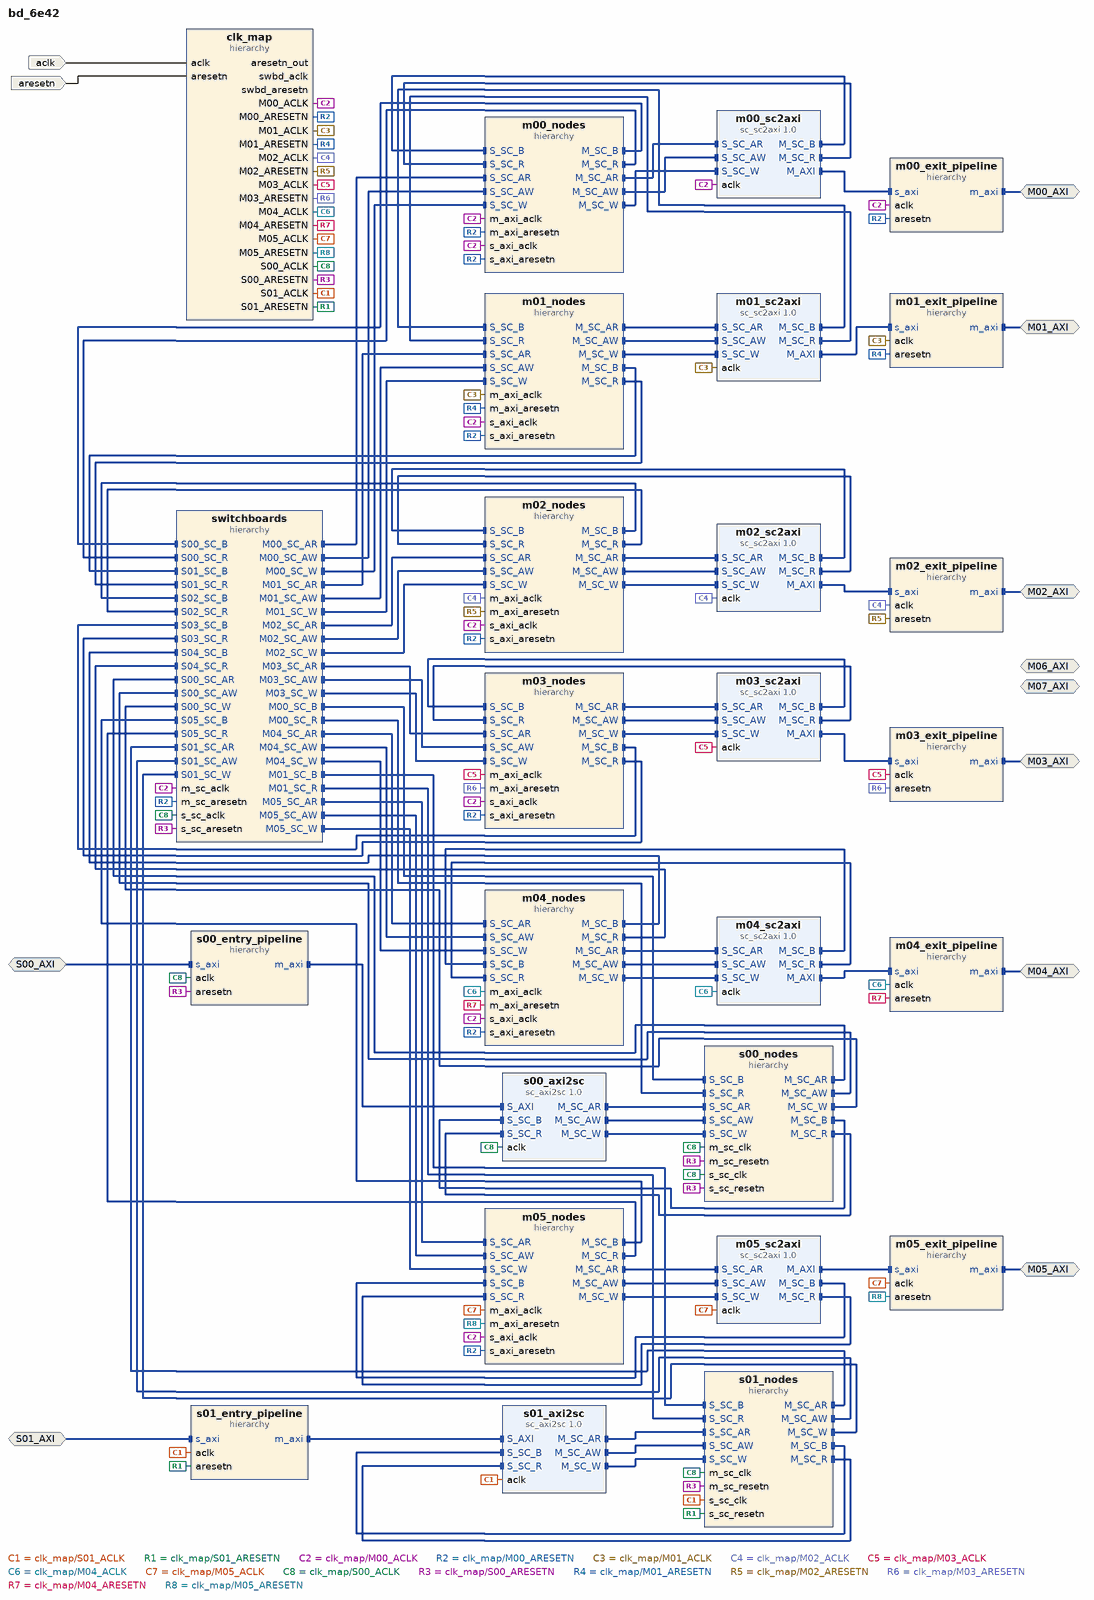
[diagram p0: block diagram of the top level]
# Vivado block design bd_6e42, xczu48dr-ffvg1517-2-e, Vivado 2025.1
create_bd_design bd_6e42

create_bd_intf_port -mode Slave -vlnv xilinx.com:interface:aximm_rtl:1.0 S00_AXI
set_property -dict {CONFIG.NUM_READ_OUTSTANDING 8 CONFIG.NUM_WRITE_OUTSTANDING 8} [get_bd_intf_ports S00_AXI]
create_bd_intf_port -mode Slave -vlnv xilinx.com:interface:aximm_rtl:1.0 S01_AXI
set_property -dict {CONFIG.NUM_READ_OUTSTANDING 8 CONFIG.NUM_WRITE_OUTSTANDING 8} [get_bd_intf_ports S01_AXI]
create_bd_intf_port -mode Master -vlnv xilinx.com:interface:aximm_rtl:1.0 M00_AXI
set_property -dict [list \
  CONFIG.NUM_READ_OUTSTANDING 8 \
  CONFIG.NUM_READ_THREADS 1 \
  CONFIG.NUM_WRITE_OUTSTANDING 8 \
  CONFIG.NUM_WRITE_THREADS 1 \
  CONFIG.RUSER_BITS_PER_BYTE 0 \
  CONFIG.WUSER_BITS_PER_BYTE 0 \
] [get_bd_intf_ports M00_AXI]
create_bd_intf_port -mode Master -vlnv xilinx.com:interface:aximm_rtl:1.0 M01_AXI
set_property -dict [list \
  CONFIG.NUM_READ_OUTSTANDING 8 \
  CONFIG.NUM_READ_THREADS 1 \
  CONFIG.NUM_WRITE_OUTSTANDING 8 \
  CONFIG.NUM_WRITE_THREADS 1 \
  CONFIG.RUSER_BITS_PER_BYTE 0 \
  CONFIG.WUSER_BITS_PER_BYTE 0 \
] [get_bd_intf_ports M01_AXI]
create_bd_intf_port -mode Master -vlnv xilinx.com:interface:aximm_rtl:1.0 M02_AXI
set_property -dict [list \
  CONFIG.NUM_READ_OUTSTANDING 8 \
  CONFIG.NUM_READ_THREADS 1 \
  CONFIG.NUM_WRITE_OUTSTANDING 8 \
  CONFIG.NUM_WRITE_THREADS 1 \
  CONFIG.RUSER_BITS_PER_BYTE 0 \
  CONFIG.WUSER_BITS_PER_BYTE 0 \
] [get_bd_intf_ports M02_AXI]
create_bd_intf_port -mode Master -vlnv xilinx.com:interface:aximm_rtl:1.0 M03_AXI
set_property -dict [list \
  CONFIG.NUM_READ_OUTSTANDING 8 \
  CONFIG.NUM_READ_THREADS 1 \
  CONFIG.NUM_WRITE_OUTSTANDING 8 \
  CONFIG.NUM_WRITE_THREADS 1 \
  CONFIG.RUSER_BITS_PER_BYTE 0 \
  CONFIG.WUSER_BITS_PER_BYTE 0 \
] [get_bd_intf_ports M03_AXI]
create_bd_intf_port -mode Master -vlnv xilinx.com:interface:aximm_rtl:1.0 M04_AXI
set_property -dict [list \
  CONFIG.NUM_READ_OUTSTANDING 8 \
  CONFIG.NUM_READ_THREADS 1 \
  CONFIG.NUM_WRITE_OUTSTANDING 8 \
  CONFIG.NUM_WRITE_THREADS 1 \
  CONFIG.RUSER_BITS_PER_BYTE 0 \
  CONFIG.WUSER_BITS_PER_BYTE 0 \
] [get_bd_intf_ports M04_AXI]
create_bd_intf_port -mode Master -vlnv xilinx.com:interface:aximm_rtl:1.0 M05_AXI
set_property -dict [list \
  CONFIG.NUM_READ_OUTSTANDING 8 \
  CONFIG.NUM_READ_THREADS 1 \
  CONFIG.NUM_WRITE_OUTSTANDING 8 \
  CONFIG.NUM_WRITE_THREADS 1 \
  CONFIG.RUSER_BITS_PER_BYTE 0 \
  CONFIG.WUSER_BITS_PER_BYTE 0 \
] [get_bd_intf_ports M05_AXI]
create_bd_intf_port -mode Master -vlnv xilinx.com:interface:aximm_rtl:1.0 M06_AXI
set_property -dict [list \
  CONFIG.NUM_READ_OUTSTANDING 8 \
  CONFIG.NUM_READ_THREADS 1 \
  CONFIG.NUM_WRITE_OUTSTANDING 8 \
  CONFIG.NUM_WRITE_THREADS 1 \
  CONFIG.RUSER_BITS_PER_BYTE 0 \
  CONFIG.WUSER_BITS_PER_BYTE 0 \
] [get_bd_intf_ports M06_AXI]
create_bd_intf_port -mode Master -vlnv xilinx.com:interface:aximm_rtl:1.0 M07_AXI
set_property -dict [list \
  CONFIG.NUM_READ_OUTSTANDING 8 \
  CONFIG.NUM_READ_THREADS 1 \
  CONFIG.NUM_WRITE_OUTSTANDING 8 \
  CONFIG.NUM_WRITE_THREADS 1 \
  CONFIG.RUSER_BITS_PER_BYTE 0 \
  CONFIG.WUSER_BITS_PER_BYTE 0 \
] [get_bd_intf_ports M07_AXI]
create_bd_port -dir I -type clk aclk
set_property -dict [list \
  CONFIG.ASSOCIATED_BUSIF M00_AXI:M01_AXI:M02_AXI:M03_AXI:M04_AXI:M05_AXI:M06_AXI:M07_AXI:S00_AXI:S01_AXI \
] [get_bd_ports aclk]
create_bd_port -dir I -type rst aresetn
set_property -dict {CONFIG.POLARITY ACTIVE_LOW} [get_bd_ports aresetn]

create_bd_cell -type hier clk_map
create_bd_cell -type hier switchboards
create_bd_cell -type hier s00_entry_pipeline
create_bd_cell -type ip -vlnv xilinx.com:ip:sc_axi2sc:1.0 s00_axi2sc
set_property -dict [list \
  CONFIG.AXI_ADDR_WIDTH 40 \
  CONFIG.AXI_ID_WIDTH 2 \
  CONFIG.AXI_RDATA_WIDTH 128 \
  CONFIG.AXI_WDATA_WIDTH 128 \
  CONFIG.MSC_ROUTE_WIDTH 10 \
  CONFIG.READ_WRITE_MODE READ_WRITE \
  CONFIG.SC_ADDR_WIDTH 40 \
  CONFIG.SC_ARUSER_WIDTH 16 \
  CONFIG.SC_AWUSER_WIDTH 16 \
  CONFIG.SC_BUSER_WIDTH 0 \
  CONFIG.SC_ID_WIDTH 2 \
  CONFIG.SC_RDATA_WIDTH 128 \
  CONFIG.SC_RUSER_BITS_PER_BYTE 0 \
  CONFIG.SC_WDATA_WIDTH 128 \
  CONFIG.SC_WUSER_BITS_PER_BYTE 0 \
  CONFIG.SSC_ROUTE_WIDTH 4 \
] [get_bd_cells s00_axi2sc]
create_bd_cell -type hier s00_nodes
create_bd_cell -type hier s01_entry_pipeline
create_bd_cell -type ip -vlnv xilinx.com:ip:sc_axi2sc:1.0 s01_axi2sc
set_property -dict [list \
  CONFIG.AXI_ADDR_WIDTH 40 \
  CONFIG.AXI_ID_WIDTH 2 \
  CONFIG.AXI_RDATA_WIDTH 128 \
  CONFIG.AXI_WDATA_WIDTH 128 \
  CONFIG.MSC_ROUTE_WIDTH 10 \
  CONFIG.READ_WRITE_MODE READ_WRITE \
  CONFIG.SC_ADDR_WIDTH 40 \
  CONFIG.SC_ARUSER_WIDTH 16 \
  CONFIG.SC_AWUSER_WIDTH 16 \
  CONFIG.SC_BUSER_WIDTH 0 \
  CONFIG.SC_ID_WIDTH 2 \
  CONFIG.SC_RDATA_WIDTH 128 \
  CONFIG.SC_RUSER_BITS_PER_BYTE 0 \
  CONFIG.SC_WDATA_WIDTH 128 \
  CONFIG.SC_WUSER_BITS_PER_BYTE 0 \
  CONFIG.SSC_ROUTE_WIDTH 4 \
] [get_bd_cells s01_axi2sc]
create_bd_cell -type hier s01_nodes
create_bd_cell -type ip -vlnv xilinx.com:ip:sc_sc2axi:1.0 m00_sc2axi
set_property -dict [list \
  CONFIG.AXI_ADDR_WIDTH 10 \
  CONFIG.AXI_ID_WIDTH 2 \
  CONFIG.AXI_RDATA_WIDTH 32 \
  CONFIG.AXI_WDATA_WIDTH 32 \
  CONFIG.MSC_ROUTE_WIDTH 10 \
  CONFIG.READ_WRITE_MODE READ_WRITE \
  CONFIG.SC_ADDR_WIDTH 40 \
  CONFIG.SC_ARUSER_WIDTH 16 \
  CONFIG.SC_AWUSER_WIDTH 16 \
  CONFIG.SC_BUSER_WIDTH 0 \
  CONFIG.SC_ID_WIDTH 2 \
  CONFIG.SC_RDATA_WIDTH 128 \
  CONFIG.SC_RUSER_BITS_PER_BYTE 0 \
  CONFIG.SC_WDATA_WIDTH 128 \
  CONFIG.SC_WUSER_BITS_PER_BYTE 0 \
  CONFIG.SSC_ROUTE_WIDTH 4 \
] [get_bd_cells m00_sc2axi]
create_bd_cell -type hier m00_nodes
create_bd_cell -type hier m00_exit_pipeline
create_bd_cell -type ip -vlnv xilinx.com:ip:sc_sc2axi:1.0 m01_sc2axi
set_property -dict [list \
  CONFIG.AXI_ADDR_WIDTH 10 \
  CONFIG.AXI_ID_WIDTH 2 \
  CONFIG.AXI_RDATA_WIDTH 32 \
  CONFIG.AXI_WDATA_WIDTH 32 \
  CONFIG.MSC_ROUTE_WIDTH 10 \
  CONFIG.READ_WRITE_MODE READ_WRITE \
  CONFIG.SC_ADDR_WIDTH 40 \
  CONFIG.SC_ARUSER_WIDTH 16 \
  CONFIG.SC_AWUSER_WIDTH 16 \
  CONFIG.SC_BUSER_WIDTH 0 \
  CONFIG.SC_ID_WIDTH 2 \
  CONFIG.SC_RDATA_WIDTH 128 \
  CONFIG.SC_RUSER_BITS_PER_BYTE 0 \
  CONFIG.SC_WDATA_WIDTH 128 \
  CONFIG.SC_WUSER_BITS_PER_BYTE 0 \
  CONFIG.SSC_ROUTE_WIDTH 4 \
] [get_bd_cells m01_sc2axi]
create_bd_cell -type hier m01_nodes
create_bd_cell -type hier m01_exit_pipeline
create_bd_cell -type ip -vlnv xilinx.com:ip:sc_sc2axi:1.0 m02_sc2axi
set_property -dict [list \
  CONFIG.AXI_ADDR_WIDTH 10 \
  CONFIG.AXI_ID_WIDTH 2 \
  CONFIG.AXI_RDATA_WIDTH 32 \
  CONFIG.AXI_WDATA_WIDTH 32 \
  CONFIG.MSC_ROUTE_WIDTH 10 \
  CONFIG.READ_WRITE_MODE READ_WRITE \
  CONFIG.SC_ADDR_WIDTH 40 \
  CONFIG.SC_ARUSER_WIDTH 16 \
  CONFIG.SC_AWUSER_WIDTH 16 \
  CONFIG.SC_BUSER_WIDTH 0 \
  CONFIG.SC_ID_WIDTH 2 \
  CONFIG.SC_RDATA_WIDTH 128 \
  CONFIG.SC_RUSER_BITS_PER_BYTE 0 \
  CONFIG.SC_WDATA_WIDTH 128 \
  CONFIG.SC_WUSER_BITS_PER_BYTE 0 \
  CONFIG.SSC_ROUTE_WIDTH 4 \
] [get_bd_cells m02_sc2axi]
create_bd_cell -type hier m02_nodes
create_bd_cell -type hier m02_exit_pipeline
create_bd_cell -type ip -vlnv xilinx.com:ip:sc_sc2axi:1.0 m03_sc2axi
set_property -dict [list \
  CONFIG.AXI_ADDR_WIDTH 10 \
  CONFIG.AXI_ID_WIDTH 2 \
  CONFIG.AXI_RDATA_WIDTH 32 \
  CONFIG.AXI_WDATA_WIDTH 32 \
  CONFIG.MSC_ROUTE_WIDTH 10 \
  CONFIG.READ_WRITE_MODE READ_WRITE \
  CONFIG.SC_ADDR_WIDTH 40 \
  CONFIG.SC_ARUSER_WIDTH 16 \
  CONFIG.SC_AWUSER_WIDTH 16 \
  CONFIG.SC_BUSER_WIDTH 0 \
  CONFIG.SC_ID_WIDTH 2 \
  CONFIG.SC_RDATA_WIDTH 128 \
  CONFIG.SC_RUSER_BITS_PER_BYTE 0 \
  CONFIG.SC_WDATA_WIDTH 128 \
  CONFIG.SC_WUSER_BITS_PER_BYTE 0 \
  CONFIG.SSC_ROUTE_WIDTH 4 \
] [get_bd_cells m03_sc2axi]
create_bd_cell -type hier m03_nodes
create_bd_cell -type hier m03_exit_pipeline
create_bd_cell -type ip -vlnv xilinx.com:ip:sc_sc2axi:1.0 m04_sc2axi
set_property -dict [list \
  CONFIG.AXI_ADDR_WIDTH 5 \
  CONFIG.AXI_ID_WIDTH 2 \
  CONFIG.AXI_RDATA_WIDTH 32 \
  CONFIG.AXI_WDATA_WIDTH 32 \
  CONFIG.MSC_ROUTE_WIDTH 10 \
  CONFIG.READ_WRITE_MODE READ_WRITE \
  CONFIG.SC_ADDR_WIDTH 40 \
  CONFIG.SC_ARUSER_WIDTH 16 \
  CONFIG.SC_AWUSER_WIDTH 16 \
  CONFIG.SC_BUSER_WIDTH 0 \
  CONFIG.SC_ID_WIDTH 2 \
  CONFIG.SC_RDATA_WIDTH 128 \
  CONFIG.SC_RUSER_BITS_PER_BYTE 0 \
  CONFIG.SC_WDATA_WIDTH 128 \
  CONFIG.SC_WUSER_BITS_PER_BYTE 0 \
  CONFIG.SSC_ROUTE_WIDTH 4 \
] [get_bd_cells m04_sc2axi]
create_bd_cell -type hier m04_nodes
create_bd_cell -type hier m04_exit_pipeline
create_bd_cell -type ip -vlnv xilinx.com:ip:sc_sc2axi:1.0 m05_sc2axi
set_property -dict [list \
  CONFIG.AXI_ADDR_WIDTH 18 \
  CONFIG.AXI_ID_WIDTH 2 \
  CONFIG.AXI_RDATA_WIDTH 32 \
  CONFIG.AXI_WDATA_WIDTH 32 \
  CONFIG.MSC_ROUTE_WIDTH 10 \
  CONFIG.READ_WRITE_MODE READ_WRITE \
  CONFIG.SC_ADDR_WIDTH 40 \
  CONFIG.SC_ARUSER_WIDTH 16 \
  CONFIG.SC_AWUSER_WIDTH 16 \
  CONFIG.SC_BUSER_WIDTH 0 \
  CONFIG.SC_ID_WIDTH 2 \
  CONFIG.SC_RDATA_WIDTH 128 \
  CONFIG.SC_RUSER_BITS_PER_BYTE 0 \
  CONFIG.SC_WDATA_WIDTH 128 \
  CONFIG.SC_WUSER_BITS_PER_BYTE 0 \
  CONFIG.SSC_ROUTE_WIDTH 4 \
] [get_bd_cells m05_sc2axi]
create_bd_cell -type hier m05_nodes
create_bd_cell -type hier m05_exit_pipeline

# ---- hierarchy /clk_map ----
current_bd_instance /clk_map
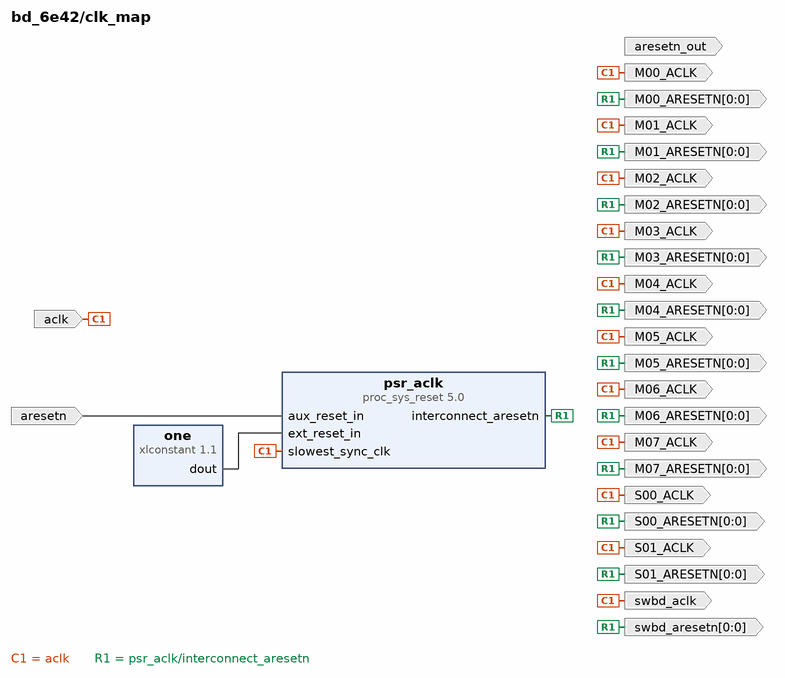
[diagram p1: block diagram inside /clk_map]
create_bd_pin -dir O -type clk S00_ACLK
create_bd_pin -dir O -from 0 -to 0 -type rst S00_ARESETN
create_bd_pin -dir O -type clk S01_ACLK
create_bd_pin -dir O -from 0 -to 0 -type rst S01_ARESETN
create_bd_pin -dir O -type clk M00_ACLK
create_bd_pin -dir O -from 0 -to 0 -type rst M00_ARESETN
create_bd_pin -dir O -type clk M01_ACLK
create_bd_pin -dir O -from 0 -to 0 -type rst M01_ARESETN
create_bd_pin -dir O -type clk M02_ACLK
create_bd_pin -dir O -from 0 -to 0 -type rst M02_ARESETN
create_bd_pin -dir O -type clk M03_ACLK
create_bd_pin -dir O -from 0 -to 0 -type rst M03_ARESETN
create_bd_pin -dir O -type clk M04_ACLK
create_bd_pin -dir O -from 0 -to 0 -type rst M04_ARESETN
create_bd_pin -dir O -type clk M05_ACLK
create_bd_pin -dir O -from 0 -to 0 -type rst M05_ARESETN
create_bd_pin -dir O -type clk M06_ACLK
create_bd_pin -dir O -from 0 -to 0 -type rst M06_ARESETN
create_bd_pin -dir O -type clk M07_ACLK
create_bd_pin -dir O -from 0 -to 0 -type rst M07_ARESETN
create_bd_pin -dir O -type clk swbd_aclk
create_bd_pin -dir O -from 0 -to 0 -type rst swbd_aresetn
create_bd_pin -dir I -type rst aresetn
create_bd_pin -dir O -type rst aresetn_out
create_bd_pin -dir I -type clk aclk

create_bd_cell -type ip -vlnv xilinx.com:ip:xlconstant:1.1 one
create_bd_cell -type ip -vlnv xilinx.com:ip:proc_sys_reset:5.0 psr_aclk
set_property -dict {CONFIG.C_AUX_RESET_HIGH 0 CONFIG.C_AUX_RST_WIDTH 1} [get_bd_cells psr_aclk]

# ---- hierarchy /switchboards ----
current_bd_instance /switchboards
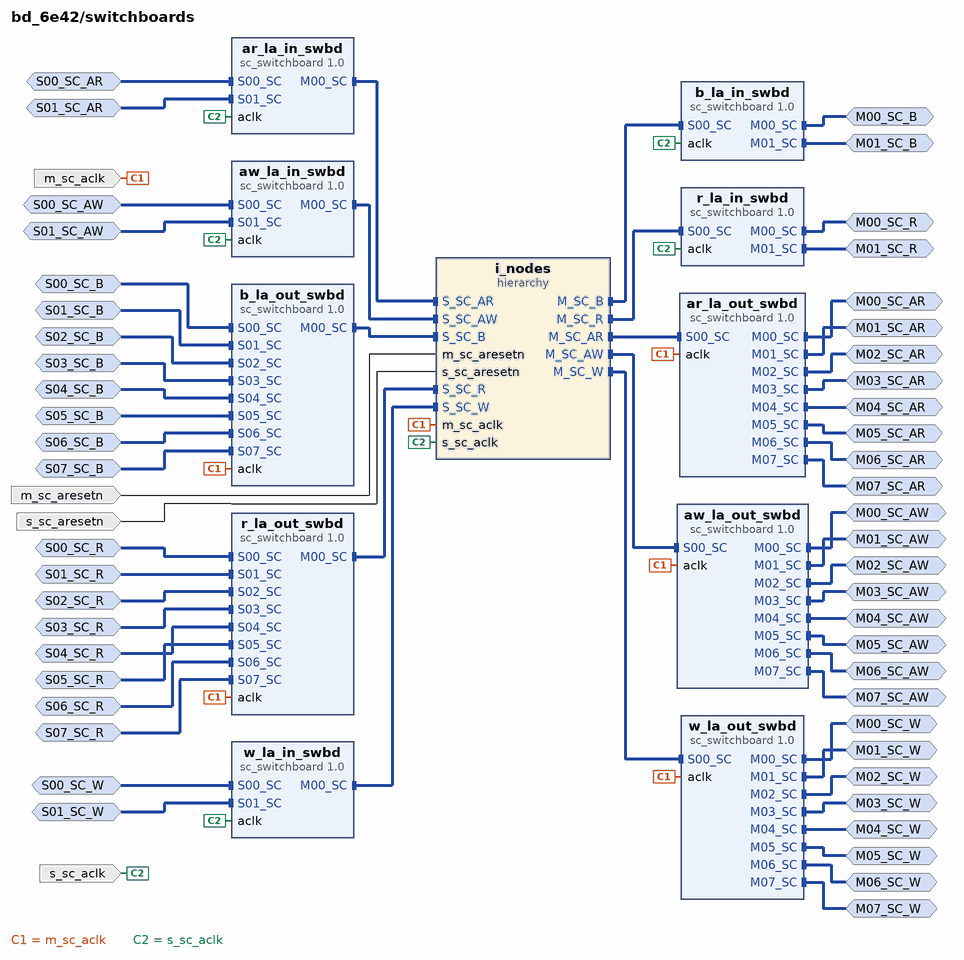
[diagram p2: block diagram inside /switchboards]
create_bd_intf_pin -mode Slave -vlnv xilinx.com:interface:sc_rtl:1.0 S00_SC_AR
create_bd_intf_pin -mode Slave -vlnv xilinx.com:interface:sc_rtl:1.0 S01_SC_AR
create_bd_intf_pin -mode Slave -vlnv xilinx.com:interface:sc_rtl:1.0 S00_SC_AW
create_bd_intf_pin -mode Slave -vlnv xilinx.com:interface:sc_rtl:1.0 S01_SC_AW
create_bd_intf_pin -mode Master -vlnv xilinx.com:interface:sc_rtl:1.0 M00_SC_B
create_bd_intf_pin -mode Master -vlnv xilinx.com:interface:sc_rtl:1.0 M01_SC_B
create_bd_intf_pin -mode Master -vlnv xilinx.com:interface:sc_rtl:1.0 M00_SC_R
create_bd_intf_pin -mode Master -vlnv xilinx.com:interface:sc_rtl:1.0 M01_SC_R
create_bd_intf_pin -mode Slave -vlnv xilinx.com:interface:sc_rtl:1.0 S00_SC_W
create_bd_intf_pin -mode Slave -vlnv xilinx.com:interface:sc_rtl:1.0 S01_SC_W
create_bd_intf_pin -mode Master -vlnv xilinx.com:interface:sc_rtl:1.0 M00_SC_AR
create_bd_intf_pin -mode Master -vlnv xilinx.com:interface:sc_rtl:1.0 M01_SC_AR
create_bd_intf_pin -mode Master -vlnv xilinx.com:interface:sc_rtl:1.0 M02_SC_AR
create_bd_intf_pin -mode Master -vlnv xilinx.com:interface:sc_rtl:1.0 M03_SC_AR
create_bd_intf_pin -mode Master -vlnv xilinx.com:interface:sc_rtl:1.0 M04_SC_AR
create_bd_intf_pin -mode Master -vlnv xilinx.com:interface:sc_rtl:1.0 M05_SC_AR
create_bd_intf_pin -mode Master -vlnv xilinx.com:interface:sc_rtl:1.0 M06_SC_AR
create_bd_intf_pin -mode Master -vlnv xilinx.com:interface:sc_rtl:1.0 M07_SC_AR
create_bd_intf_pin -mode Master -vlnv xilinx.com:interface:sc_rtl:1.0 M00_SC_AW
create_bd_intf_pin -mode Master -vlnv xilinx.com:interface:sc_rtl:1.0 M01_SC_AW
create_bd_intf_pin -mode Master -vlnv xilinx.com:interface:sc_rtl:1.0 M02_SC_AW
create_bd_intf_pin -mode Master -vlnv xilinx.com:interface:sc_rtl:1.0 M03_SC_AW
create_bd_intf_pin -mode Master -vlnv xilinx.com:interface:sc_rtl:1.0 M04_SC_AW
create_bd_intf_pin -mode Master -vlnv xilinx.com:interface:sc_rtl:1.0 M05_SC_AW
create_bd_intf_pin -mode Master -vlnv xilinx.com:interface:sc_rtl:1.0 M06_SC_AW
create_bd_intf_pin -mode Master -vlnv xilinx.com:interface:sc_rtl:1.0 M07_SC_AW
create_bd_intf_pin -mode Slave -vlnv xilinx.com:interface:sc_rtl:1.0 S00_SC_B
create_bd_intf_pin -mode Slave -vlnv xilinx.com:interface:sc_rtl:1.0 S01_SC_B
create_bd_intf_pin -mode Slave -vlnv xilinx.com:interface:sc_rtl:1.0 S02_SC_B
create_bd_intf_pin -mode Slave -vlnv xilinx.com:interface:sc_rtl:1.0 S03_SC_B
create_bd_intf_pin -mode Slave -vlnv xilinx.com:interface:sc_rtl:1.0 S04_SC_B
create_bd_intf_pin -mode Slave -vlnv xilinx.com:interface:sc_rtl:1.0 S05_SC_B
create_bd_intf_pin -mode Slave -vlnv xilinx.com:interface:sc_rtl:1.0 S06_SC_B
create_bd_intf_pin -mode Slave -vlnv xilinx.com:interface:sc_rtl:1.0 S07_SC_B
create_bd_intf_pin -mode Slave -vlnv xilinx.com:interface:sc_rtl:1.0 S00_SC_R
create_bd_intf_pin -mode Slave -vlnv xilinx.com:interface:sc_rtl:1.0 S01_SC_R
create_bd_intf_pin -mode Slave -vlnv xilinx.com:interface:sc_rtl:1.0 S02_SC_R
create_bd_intf_pin -mode Slave -vlnv xilinx.com:interface:sc_rtl:1.0 S03_SC_R
create_bd_intf_pin -mode Slave -vlnv xilinx.com:interface:sc_rtl:1.0 S04_SC_R
create_bd_intf_pin -mode Slave -vlnv xilinx.com:interface:sc_rtl:1.0 S05_SC_R
create_bd_intf_pin -mode Slave -vlnv xilinx.com:interface:sc_rtl:1.0 S06_SC_R
create_bd_intf_pin -mode Slave -vlnv xilinx.com:interface:sc_rtl:1.0 S07_SC_R
create_bd_intf_pin -mode Master -vlnv xilinx.com:interface:sc_rtl:1.0 M00_SC_W
create_bd_intf_pin -mode Master -vlnv xilinx.com:interface:sc_rtl:1.0 M01_SC_W
create_bd_intf_pin -mode Master -vlnv xilinx.com:interface:sc_rtl:1.0 M02_SC_W
create_bd_intf_pin -mode Master -vlnv xilinx.com:interface:sc_rtl:1.0 M03_SC_W
create_bd_intf_pin -mode Master -vlnv xilinx.com:interface:sc_rtl:1.0 M04_SC_W
create_bd_intf_pin -mode Master -vlnv xilinx.com:interface:sc_rtl:1.0 M05_SC_W
create_bd_intf_pin -mode Master -vlnv xilinx.com:interface:sc_rtl:1.0 M06_SC_W
create_bd_intf_pin -mode Master -vlnv xilinx.com:interface:sc_rtl:1.0 M07_SC_W
create_bd_pin -dir I -type clk s_sc_aclk
create_bd_pin -dir I -type clk m_sc_aclk
create_bd_pin -dir I -type rst s_sc_aresetn
create_bd_pin -dir I -type rst m_sc_aresetn

create_bd_cell -type ip -vlnv xilinx.com:ip:sc_switchboard:1.0 ar_la_in_swbd
set_property -dict {CONFIG.NUM_MI 1 CONFIG.NUM_SI 2 CONFIG.PAYLD_WIDTH 176} [get_bd_cells ar_la_in_swbd]
create_bd_cell -type ip -vlnv xilinx.com:ip:sc_switchboard:1.0 r_la_in_swbd
set_property -dict {CONFIG.NUM_MI 2 CONFIG.NUM_SI 1 CONFIG.PAYLD_WIDTH 153} [get_bd_cells r_la_in_swbd]
create_bd_cell -type ip -vlnv xilinx.com:ip:sc_switchboard:1.0 aw_la_in_swbd
set_property -dict {CONFIG.NUM_MI 1 CONFIG.NUM_SI 2 CONFIG.PAYLD_WIDTH 176} [get_bd_cells aw_la_in_swbd]
create_bd_cell -type ip -vlnv xilinx.com:ip:sc_switchboard:1.0 w_la_in_swbd
set_property -dict {CONFIG.NUM_MI 1 CONFIG.NUM_SI 2 CONFIG.PAYLD_WIDTH 169} [get_bd_cells w_la_in_swbd]
create_bd_cell -type ip -vlnv xilinx.com:ip:sc_switchboard:1.0 b_la_in_swbd
set_property -dict {CONFIG.NUM_MI 2 CONFIG.NUM_SI 1 CONFIG.PAYLD_WIDTH 11} [get_bd_cells b_la_in_swbd]
create_bd_cell -type ip -vlnv xilinx.com:ip:sc_switchboard:1.0 ar_la_out_swbd
set_property -dict {CONFIG.NUM_MI 8 CONFIG.NUM_SI 1 CONFIG.PAYLD_WIDTH 176} [get_bd_cells ar_la_out_swbd]
create_bd_cell -type ip -vlnv xilinx.com:ip:sc_switchboard:1.0 r_la_out_swbd
set_property -dict {CONFIG.NUM_MI 1 CONFIG.NUM_SI 8 CONFIG.PAYLD_WIDTH 153} [get_bd_cells r_la_out_swbd]
create_bd_cell -type ip -vlnv xilinx.com:ip:sc_switchboard:1.0 aw_la_out_swbd
set_property -dict {CONFIG.NUM_MI 8 CONFIG.NUM_SI 1 CONFIG.PAYLD_WIDTH 176} [get_bd_cells aw_la_out_swbd]
create_bd_cell -type ip -vlnv xilinx.com:ip:sc_switchboard:1.0 w_la_out_swbd
set_property -dict {CONFIG.NUM_MI 8 CONFIG.NUM_SI 1 CONFIG.PAYLD_WIDTH 169} [get_bd_cells w_la_out_swbd]
create_bd_cell -type ip -vlnv xilinx.com:ip:sc_switchboard:1.0 b_la_out_swbd
set_property -dict {CONFIG.NUM_MI 1 CONFIG.NUM_SI 8 CONFIG.PAYLD_WIDTH 11} [get_bd_cells b_la_out_swbd]
create_bd_cell -type hier i_nodes

# ---- hierarchy /switchboards/i_nodes ----
current_bd_instance /switchboards/i_nodes
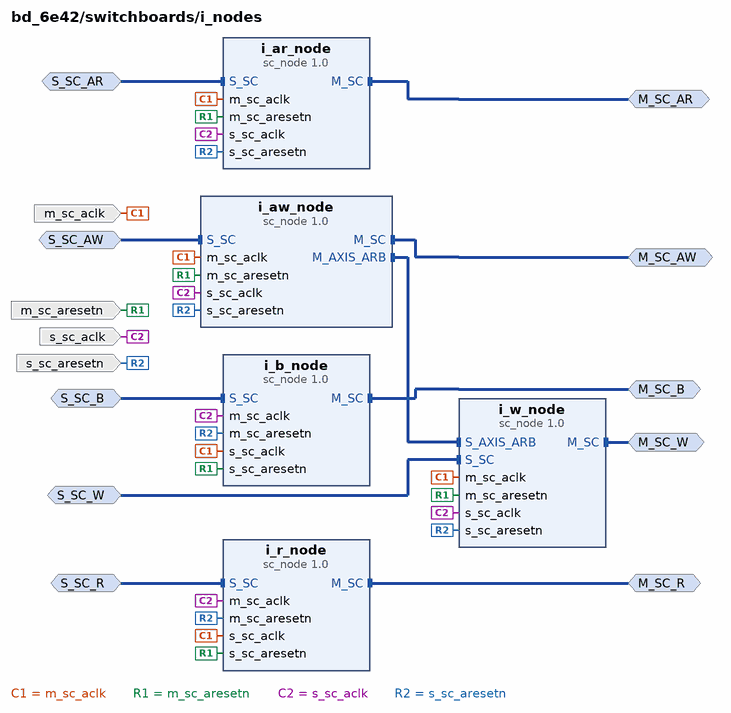
[diagram p3: block diagram inside /switchboards/i_nodes]
create_bd_intf_pin -mode Master -vlnv xilinx.com:interface:sc_rtl:1.0 M_SC_AR
create_bd_intf_pin -mode Slave -vlnv xilinx.com:interface:sc_rtl:1.0 S_SC_AR
create_bd_intf_pin -mode Master -vlnv xilinx.com:interface:sc_rtl:1.0 M_SC_R
create_bd_intf_pin -mode Slave -vlnv xilinx.com:interface:sc_rtl:1.0 S_SC_R
create_bd_intf_pin -mode Master -vlnv xilinx.com:interface:sc_rtl:1.0 M_SC_AW
create_bd_intf_pin -mode Slave -vlnv xilinx.com:interface:sc_rtl:1.0 S_SC_AW
create_bd_intf_pin -mode Master -vlnv xilinx.com:interface:sc_rtl:1.0 M_SC_W
create_bd_intf_pin -mode Slave -vlnv xilinx.com:interface:sc_rtl:1.0 S_SC_W
create_bd_intf_pin -mode Master -vlnv xilinx.com:interface:sc_rtl:1.0 M_SC_B
create_bd_intf_pin -mode Slave -vlnv xilinx.com:interface:sc_rtl:1.0 S_SC_B
create_bd_pin -dir I -type clk s_sc_aclk
create_bd_pin -dir I -type clk m_sc_aclk
create_bd_pin -dir I -type rst s_sc_aresetn
create_bd_pin -dir I -type rst m_sc_aresetn

create_bd_cell -type ip -vlnv xilinx.com:ip:sc_node:1.0 i_ar_node
set_property -dict [list \
  CONFIG.ACLKEN_CONVERSION 0 \
  CONFIG.ACLK_RELATIONSHIP 1 \
  CONFIG.ADDR_WIDTH 40 \
  CONFIG.CHANNEL 2 \
  CONFIG.FIFO_SIZE 0 \
  CONFIG.FIFO_TYPE 0 \
  CONFIG.ID_WIDTH 2 \
  CONFIG.M00_NUM_BYTES 4 \
  CONFIG.M01_NUM_BYTES 4 \
  CONFIG.M02_NUM_BYTES 4 \
  CONFIG.M03_NUM_BYTES 4 \
  CONFIG.M04_NUM_BYTES 4 \
  CONFIG.M05_NUM_BYTES 4 \
  CONFIG.M06_NUM_BYTES 4 \
  CONFIG.M07_NUM_BYTES 4 \
  CONFIG.M08_NUM_BYTES 4 \
  CONFIG.M09_NUM_BYTES 4 \
  CONFIG.M10_NUM_BYTES 4 \
  CONFIG.M11_NUM_BYTES 4 \
  CONFIG.M12_NUM_BYTES 4 \
  CONFIG.M13_NUM_BYTES 4 \
  CONFIG.M14_NUM_BYTES 4 \
  CONFIG.M15_NUM_BYTES 4 \
  CONFIG.MAX_PAYLD_BYTES 16 \
  CONFIG.M_SEND_PIPELINE 0 \
  CONFIG.NUM_MI 8 \
  CONFIG.NUM_OUTSTANDING 8 \
  CONFIG.NUM_SI 2 \
  CONFIG.PAYLD_WIDTH 176 \
  CONFIG.S00_NUM_BYTES 16 \
  CONFIG.S01_NUM_BYTES 16 \
  CONFIG.S02_NUM_BYTES 16 \
  CONFIG.S03_NUM_BYTES 16 \
  CONFIG.S04_NUM_BYTES 16 \
  CONFIG.S05_NUM_BYTES 16 \
  CONFIG.S06_NUM_BYTES 16 \
  CONFIG.S07_NUM_BYTES 16 \
  CONFIG.S08_NUM_BYTES 16 \
  CONFIG.S09_NUM_BYTES 16 \
  CONFIG.S10_NUM_BYTES 16 \
  CONFIG.S11_NUM_BYTES 16 \
  CONFIG.S12_NUM_BYTES 16 \
  CONFIG.S13_NUM_BYTES 16 \
  CONFIG.S14_NUM_BYTES 16 \
  CONFIG.S15_NUM_BYTES 16 \
  CONFIG.SC_ROUTE_WIDTH 10 \
  CONFIG.USER_WIDTH 16 \
] [get_bd_cells i_ar_node]
create_bd_cell -type ip -vlnv xilinx.com:ip:sc_node:1.0 i_r_node
set_property -dict [list \
  CONFIG.ACLKEN_CONVERSION 0 \
  CONFIG.ACLK_RELATIONSHIP 1 \
  CONFIG.ADDR_WIDTH 40 \
  CONFIG.CHANNEL 0 \
  CONFIG.FIFO_SIZE 0 \
  CONFIG.FIFO_TYPE 0 \
  CONFIG.ID_WIDTH 2 \
  CONFIG.M00_NUM_BYTES 16 \
  CONFIG.M01_NUM_BYTES 16 \
  CONFIG.M02_NUM_BYTES 16 \
  CONFIG.M03_NUM_BYTES 16 \
  CONFIG.M04_NUM_BYTES 16 \
  CONFIG.M05_NUM_BYTES 16 \
  CONFIG.M06_NUM_BYTES 16 \
  CONFIG.M07_NUM_BYTES 16 \
  CONFIG.M08_NUM_BYTES 16 \
  CONFIG.M09_NUM_BYTES 16 \
  CONFIG.M10_NUM_BYTES 16 \
  CONFIG.M11_NUM_BYTES 16 \
  CONFIG.M12_NUM_BYTES 16 \
  CONFIG.M13_NUM_BYTES 16 \
  CONFIG.M14_NUM_BYTES 16 \
  CONFIG.M15_NUM_BYTES 16 \
  CONFIG.MAX_PAYLD_BYTES 16 \
  CONFIG.M_SEND_PIPELINE 0 \
  CONFIG.NUM_MI 2 \
  CONFIG.NUM_OUTSTANDING 8 \
  CONFIG.NUM_SI 8 \
  CONFIG.PAYLD_WIDTH 153 \
  CONFIG.S00_NUM_BYTES 4 \
  CONFIG.S01_NUM_BYTES 4 \
  CONFIG.S02_NUM_BYTES 4 \
  CONFIG.S03_NUM_BYTES 4 \
  CONFIG.S04_NUM_BYTES 4 \
  CONFIG.S05_NUM_BYTES 4 \
  CONFIG.S06_NUM_BYTES 4 \
  CONFIG.S07_NUM_BYTES 4 \
  CONFIG.S08_NUM_BYTES 4 \
  CONFIG.S09_NUM_BYTES 4 \
  CONFIG.S10_NUM_BYTES 4 \
  CONFIG.S11_NUM_BYTES 4 \
  CONFIG.S12_NUM_BYTES 4 \
  CONFIG.S13_NUM_BYTES 4 \
  CONFIG.S14_NUM_BYTES 4 \
  CONFIG.S15_NUM_BYTES 4 \
  CONFIG.SC_ROUTE_WIDTH 4 \
  CONFIG.USER_BITS_PER_BYTE 0 \
] [get_bd_cells i_r_node]
create_bd_cell -type ip -vlnv xilinx.com:ip:sc_node:1.0 i_aw_node
set_property -dict [list \
  CONFIG.ACLKEN_CONVERSION 0 \
  CONFIG.ACLK_RELATIONSHIP 1 \
  CONFIG.ADDR_WIDTH 40 \
  CONFIG.CHANNEL 3 \
  CONFIG.FIFO_SIZE 0 \
  CONFIG.FIFO_TYPE 0 \
  CONFIG.ID_WIDTH 2 \
  CONFIG.M00_NUM_BYTES 4 \
  CONFIG.M01_NUM_BYTES 4 \
  CONFIG.M02_NUM_BYTES 4 \
  CONFIG.M03_NUM_BYTES 4 \
  CONFIG.M04_NUM_BYTES 4 \
  CONFIG.M05_NUM_BYTES 4 \
  CONFIG.M06_NUM_BYTES 4 \
  CONFIG.M07_NUM_BYTES 4 \
  CONFIG.M08_NUM_BYTES 4 \
  CONFIG.M09_NUM_BYTES 4 \
  CONFIG.M10_NUM_BYTES 4 \
  CONFIG.M11_NUM_BYTES 4 \
  CONFIG.M12_NUM_BYTES 4 \
  CONFIG.M13_NUM_BYTES 4 \
  CONFIG.M14_NUM_BYTES 4 \
  CONFIG.M15_NUM_BYTES 4 \
  CONFIG.MAX_PAYLD_BYTES 16 \
  CONFIG.M_SEND_PIPELINE 0 \
  CONFIG.NUM_MI 8 \
  CONFIG.NUM_OUTSTANDING 8 \
  CONFIG.NUM_SI 2 \
  CONFIG.PAYLD_WIDTH 176 \
  CONFIG.S00_NUM_BYTES 16 \
  CONFIG.S01_NUM_BYTES 16 \
  CONFIG.S02_NUM_BYTES 16 \
  CONFIG.S03_NUM_BYTES 16 \
  CONFIG.S04_NUM_BYTES 16 \
  CONFIG.S05_NUM_BYTES 16 \
  CONFIG.S06_NUM_BYTES 16 \
  CONFIG.S07_NUM_BYTES 16 \
  CONFIG.S08_NUM_BYTES 16 \
  CONFIG.S09_NUM_BYTES 16 \
  CONFIG.S10_NUM_BYTES 16 \
  CONFIG.S11_NUM_BYTES 16 \
  CONFIG.S12_NUM_BYTES 16 \
  CONFIG.S13_NUM_BYTES 16 \
  CONFIG.S14_NUM_BYTES 16 \
  CONFIG.S15_NUM_BYTES 16 \
  CONFIG.SC_ROUTE_WIDTH 10 \
  CONFIG.USER_WIDTH 16 \
] [get_bd_cells i_aw_node]
create_bd_cell -type ip -vlnv xilinx.com:ip:sc_node:1.0 i_w_node
set_property -dict [list \
  CONFIG.ACLKEN_CONVERSION 0 \
  CONFIG.ACLK_RELATIONSHIP 1 \
  CONFIG.ADDR_WIDTH 40 \
  CONFIG.CHANNEL 1 \
  CONFIG.FIFO_SIZE 0 \
  CONFIG.FIFO_TYPE 0 \
  CONFIG.ID_WIDTH 2 \
  CONFIG.M00_NUM_BYTES 4 \
  CONFIG.M01_NUM_BYTES 4 \
  CONFIG.M02_NUM_BYTES 4 \
  CONFIG.M03_NUM_BYTES 4 \
  CONFIG.M04_NUM_BYTES 4 \
  CONFIG.M05_NUM_BYTES 4 \
  CONFIG.M06_NUM_BYTES 4 \
  CONFIG.M07_NUM_BYTES 4 \
  CONFIG.M08_NUM_BYTES 4 \
  CONFIG.M09_NUM_BYTES 4 \
  CONFIG.M10_NUM_BYTES 4 \
  CONFIG.M11_NUM_BYTES 4 \
  CONFIG.M12_NUM_BYTES 4 \
  CONFIG.M13_NUM_BYTES 4 \
  CONFIG.M14_NUM_BYTES 4 \
  CONFIG.M15_NUM_BYTES 4 \
  CONFIG.MAX_PAYLD_BYTES 16 \
  CONFIG.M_SEND_PIPELINE 0 \
  CONFIG.NUM_MI 8 \
  CONFIG.NUM_OUTSTANDING 8 \
  CONFIG.NUM_SI 2 \
  CONFIG.PAYLD_WIDTH 169 \
  CONFIG.S00_NUM_BYTES 16 \
  CONFIG.S01_NUM_BYTES 16 \
  CONFIG.S02_NUM_BYTES 16 \
  CONFIG.S03_NUM_BYTES 16 \
  CONFIG.S04_NUM_BYTES 16 \
  CONFIG.S05_NUM_BYTES 16 \
  CONFIG.S06_NUM_BYTES 16 \
  CONFIG.S07_NUM_BYTES 16 \
  CONFIG.S08_NUM_BYTES 16 \
  CONFIG.S09_NUM_BYTES 16 \
  CONFIG.S10_NUM_BYTES 16 \
  CONFIG.S11_NUM_BYTES 16 \
  CONFIG.S12_NUM_BYTES 16 \
  CONFIG.S13_NUM_BYTES 16 \
  CONFIG.S14_NUM_BYTES 16 \
  CONFIG.S15_NUM_BYTES 16 \
  CONFIG.SC_ROUTE_WIDTH 10 \
  CONFIG.USER_BITS_PER_BYTE 0 \
] [get_bd_cells i_w_node]
create_bd_cell -type ip -vlnv xilinx.com:ip:sc_node:1.0 i_b_node
set_property -dict [list \
  CONFIG.ACLKEN_CONVERSION 0 \
  CONFIG.ACLK_RELATIONSHIP 1 \
  CONFIG.ADDR_WIDTH 40 \
  CONFIG.CHANNEL 4 \
  CONFIG.FIFO_SIZE 0 \
  CONFIG.FIFO_TYPE 0 \
  CONFIG.ID_WIDTH 2 \
  CONFIG.M00_NUM_BYTES 16 \
  CONFIG.M01_NUM_BYTES 16 \
  CONFIG.M02_NUM_BYTES 16 \
  CONFIG.M03_NUM_BYTES 16 \
  CONFIG.M04_NUM_BYTES 16 \
  CONFIG.M05_NUM_BYTES 16 \
  CONFIG.M06_NUM_BYTES 16 \
  CONFIG.M07_NUM_BYTES 16 \
  CONFIG.M08_NUM_BYTES 16 \
  CONFIG.M09_NUM_BYTES 16 \
  CONFIG.M10_NUM_BYTES 16 \
  CONFIG.M11_NUM_BYTES 16 \
  CONFIG.M12_NUM_BYTES 16 \
  CONFIG.M13_NUM_BYTES 16 \
  CONFIG.M14_NUM_BYTES 16 \
  CONFIG.M15_NUM_BYTES 16 \
  CONFIG.MAX_PAYLD_BYTES 16 \
  CONFIG.M_SEND_PIPELINE 0 \
  CONFIG.NUM_MI 2 \
  CONFIG.NUM_OUTSTANDING 8 \
  CONFIG.NUM_SI 8 \
  CONFIG.PAYLD_WIDTH 11 \
  CONFIG.S00_NUM_BYTES 4 \
  CONFIG.S01_NUM_BYTES 4 \
  CONFIG.S02_NUM_BYTES 4 \
  CONFIG.S03_NUM_BYTES 4 \
  CONFIG.S04_NUM_BYTES 4 \
  CONFIG.S05_NUM_BYTES 4 \
  CONFIG.S06_NUM_BYTES 4 \
  CONFIG.S07_NUM_BYTES 4 \
  CONFIG.S08_NUM_BYTES 4 \
  CONFIG.S09_NUM_BYTES 4 \
  CONFIG.S10_NUM_BYTES 4 \
  CONFIG.S11_NUM_BYTES 4 \
  CONFIG.S12_NUM_BYTES 4 \
  CONFIG.S13_NUM_BYTES 4 \
  CONFIG.S14_NUM_BYTES 4 \
  CONFIG.S15_NUM_BYTES 4 \
  CONFIG.SC_ROUTE_WIDTH 4 \
  CONFIG.USER_WIDTH 0 \
] [get_bd_cells i_b_node]

# ---- hierarchy /s00_entry_pipeline ----
current_bd_instance /s00_entry_pipeline
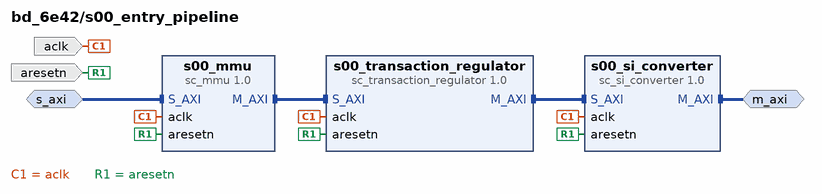
[diagram p4: block diagram inside /s00_entry_pipeline]
create_bd_intf_pin -mode Slave -vlnv xilinx.com:interface:aximm_rtl:1.0 s_axi
create_bd_intf_pin -mode Master -vlnv xilinx.com:interface:aximm_rtl:1.0 m_axi
create_bd_pin -dir I -type clk aclk
create_bd_pin -dir I -type rst aresetn

create_bd_cell -type ip -vlnv xilinx.com:ip:sc_mmu:1.0 s00_mmu
set_property -dict [list \
  CONFIG.ADDR_WIDTH 40 \
  CONFIG.ENABLE_PIPELINING 0 \
  CONFIG.ID_WIDTH 16 \
  CONFIG.IS_CASCADED 0 \
  CONFIG.MSC000_ROUTE 0b1000000011 \
  CONFIG.MSC001_ROUTE 0b1000000101 \
  CONFIG.MSC002_ROUTE 0b1000001001 \
  CONFIG.MSC003_ROUTE 0b1000010001 \
  CONFIG.MSC004_ROUTE 0b1000100001 \
  CONFIG.MSC005_ROUTE 0b1001000001 \
  CONFIG.MSC006_ROUTE 0b1010000001 \
  CONFIG.MSC007_ROUTE 0b1100000001 \
  CONFIG.MSC_ROUTE_WIDTH 10 \
  CONFIG.NUM_MSC 8 \
  CONFIG.NUM_READ_OUTSTANDING 8 \
  CONFIG.NUM_SEG 6 \
  CONFIG.NUM_WRITE_OUTSTANDING 8 \
  CONFIG.RDATA_WIDTH 128 \
  CONFIG.READ_WRITE_MODE READ_WRITE \
  CONFIG.SEG000_BASE_ADDR 0x00000000A0000000 \
  CONFIG.SEG000_SECURE_READ 0 \
  CONFIG.SEG000_SECURE_WRITE 0 \
  CONFIG.SEG000_SEP_ROUTE 0b0000000000000000000000000000000000000000000000000000000000000000 \
  CONFIG.SEG000_SIZE 16 \
  CONFIG.SEG000_SUPPORTS_READ 1 \
  CONFIG.SEG000_SUPPORTS_WRITE 1 \
  CONFIG.SEG001_BASE_ADDR 0x00000000A0010000 \
  CONFIG.SEG001_SECURE_READ 0 \
  CONFIG.SEG001_SECURE_WRITE 0 \
  CONFIG.SEG001_SEP_ROUTE 0b0000000000000000000000000000000000000000000000000000000000000001 \
  CONFIG.SEG001_SIZE 16 \
  CONFIG.SEG001_SUPPORTS_READ 1 \
  CONFIG.SEG001_SUPPORTS_WRITE 1 \
  CONFIG.SEG002_BASE_ADDR 0x00000000A0020000 \
  CONFIG.SEG002_SECURE_READ 0 \
  CONFIG.SEG002_SECURE_WRITE 0 \
  CONFIG.SEG002_SEP_ROUTE 0b0000000000000000000000000000000000000000000000000000000000000010 \
  CONFIG.SEG002_SIZE 16 \
  CONFIG.SEG002_SUPPORTS_READ 1 \
  CONFIG.SEG002_SUPPORTS_WRITE 1 \
  CONFIG.SEG003_BASE_ADDR 0x00000000A0030000 \
  CONFIG.SEG003_SECURE_READ 0 \
  CONFIG.SEG003_SECURE_WRITE 0 \
  CONFIG.SEG003_SEP_ROUTE 0b0000000000000000000000000000000000000000000000000000000000000011 \
  CONFIG.SEG003_SIZE 16 \
  CONFIG.SEG003_SUPPORTS_READ 1 \
  CONFIG.SEG003_SUPPORTS_WRITE 1 \
  CONFIG.SEG004_BASE_ADDR 0x00000000A0040000 \
  CONFIG.SEG004_SECURE_READ 0 \
  CONFIG.SEG004_SECURE_WRITE 0 \
  CONFIG.SEG004_SEP_ROUTE 0b0000000000000000000000000000000000000000000000000000000000000101 \
  CONFIG.SEG004_SIZE 18 \
  CONFIG.SEG004_SUPPORTS_READ 1 \
  CONFIG.SEG004_SUPPORTS_WRITE 1 \
  CONFIG.SEG005_BASE_ADDR 0x00000000A0080000 \
  CONFIG.SEG005_SECURE_READ 0 \
  CONFIG.SEG005_SECURE_WRITE 0 \
  CONFIG.SEG005_SEP_ROUTE 0b0000000000000000000000000000000000000000000000000000000000000100 \
  CONFIG.SEG005_SIZE 16 \
  CONFIG.SEG005_SUPPORTS_READ 1 \
  CONFIG.SEG005_SUPPORTS_WRITE 1 \
  CONFIG.SINGLE_ISSUING 1 \
  CONFIG.SUPPORTS_NARROW 1 \
  CONFIG.S_ARUSER_WIDTH 16 \
  CONFIG.S_AWUSER_WIDTH 16 \
  CONFIG.S_BUSER_WIDTH 0 \
  CONFIG.S_PROTOCOL AXI4 \
  CONFIG.S_RUSER_WIDTH 0 \
  CONFIG.S_WUSER_WIDTH 0 \
  CONFIG.WDATA_WIDTH 128 \
] [get_bd_cells s00_mmu]
create_bd_cell -type ip -vlnv xilinx.com:ip:sc_transaction_regulator:1.0 s00_transaction_regulator
set_property -dict [list \
  CONFIG.ADDR_WIDTH 40 \
  CONFIG.IS_CASCADED 0 \
  CONFIG.MEP_IDENTIFIER 1 \
  CONFIG.MEP_IDENTIFIER_WIDTH 2 \
  CONFIG.NUM_READ_OUTSTANDING 8 \
  CONFIG.NUM_READ_THREADS 1 \
  CONFIG.NUM_WRITE_OUTSTANDING 8 \
  CONFIG.NUM_WRITE_THREADS 1 \
  CONFIG.RDATA_WIDTH 128 \
  CONFIG.READ_WRITE_MODE READ_WRITE \
  CONFIG.SEP_ROUTE_WIDTH 3 \
  CONFIG.SINGLE_ISSUING 1 \
  CONFIG.SUPPORTS_READ_DEADLOCK 0 \
  CONFIG.SUPPORTS_WRITE_DEADLOCK 0 \
  CONFIG.S_ID_WIDTH 16 \
  CONFIG.WDATA_WIDTH 128 \
] [get_bd_cells s00_transaction_regulator]
create_bd_cell -type ip -vlnv xilinx.com:ip:sc_si_converter:1.0 s00_si_converter
set_property -dict [list \
  CONFIG.ADDR_WIDTH 40 \
  CONFIG.HAS_BURST 1 \
  CONFIG.ID_WIDTH 2 \
  CONFIG.IS_CASCADED 0 \
  CONFIG.MAX_RUSER_BITS_PER_BYTE 0 \
  CONFIG.MAX_WUSER_BITS_PER_BYTE 0 \
  CONFIG.MEP_IDENTIFIER_WIDTH 2 \
  CONFIG.MSC000_RDATA_WIDTH 32 \
  CONFIG.MSC000_WDATA_WIDTH 32 \
  CONFIG.MSC001_RDATA_WIDTH 32 \
  CONFIG.MSC001_WDATA_WIDTH 32 \
  CONFIG.MSC002_RDATA_WIDTH 32 \
  CONFIG.MSC002_WDATA_WIDTH 32 \
  CONFIG.MSC003_RDATA_WIDTH 32 \
  CONFIG.MSC003_WDATA_WIDTH 32 \
  CONFIG.MSC004_RDATA_WIDTH 32 \
  CONFIG.MSC004_WDATA_WIDTH 32 \
  CONFIG.MSC005_RDATA_WIDTH 32 \
  CONFIG.MSC005_WDATA_WIDTH 32 \
  CONFIG.NUM_MSC 8 \
  CONFIG.NUM_READ_OUTSTANDING 8 \
  CONFIG.NUM_READ_THREADS 1 \
  CONFIG.NUM_SEG 6 \
  CONFIG.NUM_WRITE_OUTSTANDING 8 \
  CONFIG.NUM_WRITE_THREADS 1 \
  CONFIG.RDATA_WIDTH 128 \
  CONFIG.READ_WATERMARK 0 \
  CONFIG.READ_WRITE_MODE READ_WRITE \
  CONFIG.SEP000_PROTOCOL AXI4LITE \
  CONFIG.SEP000_RDATA_WIDTH 32 \
  CONFIG.SEP000_WDATA_WIDTH 32 \
  CONFIG.SEP001_PROTOCOL AXI4LITE \
  CONFIG.SEP001_RDATA_WIDTH 32 \
  CONFIG.SEP001_WDATA_WIDTH 32 \
  CONFIG.SEP002_PROTOCOL AXI4LITE \
  CONFIG.SEP002_RDATA_WIDTH 32 \
  CONFIG.SEP002_WDATA_WIDTH 32 \
  CONFIG.SEP003_PROTOCOL AXI4LITE \
  CONFIG.SEP003_RDATA_WIDTH 32 \
  CONFIG.SEP003_WDATA_WIDTH 32 \
  CONFIG.SEP004_PROTOCOL AXI4LITE \
  CONFIG.SEP004_RDATA_WIDTH 32 \
  CONFIG.SEP004_WDATA_WIDTH 32 \
  CONFIG.SEP005_PROTOCOL AXI4LITE \
  CONFIG.SEP005_RDATA_WIDTH 32 \
  CONFIG.SEP005_WDATA_WIDTH 32 \
  CONFIG.SINGLE_ISSUING 1 \
  CONFIG.SPLIT_WRAP_NARROW 0 \
  CONFIG.SUPPORTS_NARROW 1 \
  CONFIG.S_RUSER_BITS_PER_BYTE 0 \
  CONFIG.S_WUSER_BITS_PER_BYTE 0 \
  CONFIG.WDATA_WIDTH 128 \
  CONFIG.WRITE_WATERMARK 0 \
] [get_bd_cells s00_si_converter]

# ---- hierarchy /s00_nodes ----
current_bd_instance /s00_nodes
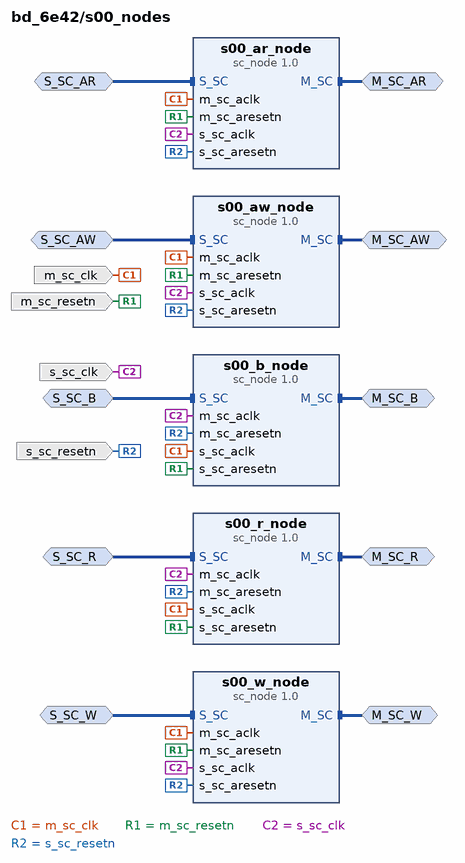
[diagram p5: block diagram inside /s00_nodes]
create_bd_intf_pin -mode Master -vlnv xilinx.com:interface:sc_rtl:1.0 M_SC_AR
create_bd_intf_pin -mode Slave -vlnv xilinx.com:interface:sc_rtl:1.0 S_SC_AR
create_bd_intf_pin -mode Master -vlnv xilinx.com:interface:sc_rtl:1.0 M_SC_R
create_bd_intf_pin -mode Slave -vlnv xilinx.com:interface:sc_rtl:1.0 S_SC_R
create_bd_intf_pin -mode Master -vlnv xilinx.com:interface:sc_rtl:1.0 M_SC_AW
create_bd_intf_pin -mode Slave -vlnv xilinx.com:interface:sc_rtl:1.0 S_SC_AW
create_bd_intf_pin -mode Master -vlnv xilinx.com:interface:sc_rtl:1.0 M_SC_W
create_bd_intf_pin -mode Slave -vlnv xilinx.com:interface:sc_rtl:1.0 S_SC_W
create_bd_intf_pin -mode Master -vlnv xilinx.com:interface:sc_rtl:1.0 M_SC_B
create_bd_intf_pin -mode Slave -vlnv xilinx.com:interface:sc_rtl:1.0 S_SC_B
create_bd_pin -dir I -type clk s_sc_clk
create_bd_pin -dir I -type rst s_sc_resetn
create_bd_pin -dir I -type clk m_sc_clk
create_bd_pin -dir I -type rst m_sc_resetn

create_bd_cell -type ip -vlnv xilinx.com:ip:sc_node:1.0 s00_ar_node
set_property -dict [list \
  CONFIG.ACLKEN_CONVERSION 0 \
  CONFIG.ACLK_RELATIONSHIP 1 \
  CONFIG.ADDR_WIDTH 40 \
  CONFIG.CHANNEL 2 \
  CONFIG.FIFO_TYPE 2 \
  CONFIG.ID_WIDTH 2 \
  CONFIG.M00_NUM_BYTES 16 \
  CONFIG.M01_NUM_BYTES 16 \
  CONFIG.M02_NUM_BYTES 16 \
  CONFIG.M03_NUM_BYTES 16 \
  CONFIG.M04_NUM_BYTES 16 \
  CONFIG.M05_NUM_BYTES 16 \
  CONFIG.M06_NUM_BYTES 16 \
  CONFIG.M07_NUM_BYTES 16 \
  CONFIG.M08_NUM_BYTES 16 \
  CONFIG.M09_NUM_BYTES 16 \
  CONFIG.M10_NUM_BYTES 16 \
  CONFIG.M11_NUM_BYTES 16 \
  CONFIG.M12_NUM_BYTES 16 \
  CONFIG.M13_NUM_BYTES 16 \
  CONFIG.M14_NUM_BYTES 16 \
  CONFIG.M15_NUM_BYTES 16 \
  CONFIG.MAX_PAYLD_BYTES 16 \
  CONFIG.NUM_MI 1 \
  CONFIG.NUM_OUTSTANDING 8 \
  CONFIG.NUM_SI 1 \
  CONFIG.PAYLD_WIDTH 176 \
  CONFIG.S00_NUM_BYTES 16 \
  CONFIG.S01_NUM_BYTES 16 \
  CONFIG.S02_NUM_BYTES 16 \
  CONFIG.S03_NUM_BYTES 16 \
  CONFIG.S04_NUM_BYTES 16 \
  CONFIG.S05_NUM_BYTES 16 \
  CONFIG.S06_NUM_BYTES 16 \
  CONFIG.S07_NUM_BYTES 16 \
  CONFIG.S08_NUM_BYTES 16 \
  CONFIG.S09_NUM_BYTES 16 \
  CONFIG.S10_NUM_BYTES 16 \
  CONFIG.S11_NUM_BYTES 16 \
  CONFIG.S12_NUM_BYTES 16 \
  CONFIG.S13_NUM_BYTES 16 \
  CONFIG.S14_NUM_BYTES 16 \
  CONFIG.S15_NUM_BYTES 16 \
  CONFIG.SC_ROUTE_WIDTH 10 \
  CONFIG.USER_WIDTH 16 \
] [get_bd_cells s00_ar_node]
create_bd_cell -type ip -vlnv xilinx.com:ip:sc_node:1.0 s00_r_node
set_property -dict [list \
  CONFIG.ACLKEN_CONVERSION 0 \
  CONFIG.ACLK_RELATIONSHIP 1 \
  CONFIG.ADDR_WIDTH 40 \
  CONFIG.CHANNEL 0 \
  CONFIG.FIFO_TYPE 2 \
  CONFIG.ID_WIDTH 2 \
  CONFIG.M00_NUM_BYTES 16 \
  CONFIG.M01_NUM_BYTES 16 \
  CONFIG.M02_NUM_BYTES 16 \
  CONFIG.M03_NUM_BYTES 16 \
  CONFIG.M04_NUM_BYTES 16 \
  CONFIG.M05_NUM_BYTES 16 \
  CONFIG.M06_NUM_BYTES 16 \
  CONFIG.M07_NUM_BYTES 16 \
  CONFIG.M08_NUM_BYTES 16 \
  CONFIG.M09_NUM_BYTES 16 \
  CONFIG.M10_NUM_BYTES 16 \
  CONFIG.M11_NUM_BYTES 16 \
  CONFIG.M12_NUM_BYTES 16 \
  CONFIG.M13_NUM_BYTES 16 \
  CONFIG.M14_NUM_BYTES 16 \
  CONFIG.M15_NUM_BYTES 16 \
  CONFIG.MAX_PAYLD_BYTES 16 \
  CONFIG.M_SEND_PIPELINE 0 \
  CONFIG.NUM_MI 1 \
  CONFIG.NUM_OUTSTANDING 8 \
  CONFIG.NUM_SI 1 \
  CONFIG.PAYLD_WIDTH 153 \
  CONFIG.S00_NUM_BYTES 16 \
  CONFIG.S01_NUM_BYTES 16 \
  CONFIG.S02_NUM_BYTES 16 \
  CONFIG.S03_NUM_BYTES 16 \
  CONFIG.S04_NUM_BYTES 16 \
  CONFIG.S05_NUM_BYTES 16 \
  CONFIG.S06_NUM_BYTES 16 \
  CONFIG.S07_NUM_BYTES 16 \
  CONFIG.S08_NUM_BYTES 16 \
  CONFIG.S09_NUM_BYTES 16 \
  CONFIG.S10_NUM_BYTES 16 \
  CONFIG.S11_NUM_BYTES 16 \
  CONFIG.S12_NUM_BYTES 16 \
  CONFIG.S13_NUM_BYTES 16 \
  CONFIG.S14_NUM_BYTES 16 \
  CONFIG.S15_NUM_BYTES 16 \
  CONFIG.SC_ROUTE_WIDTH 4 \
  CONFIG.USER_BITS_PER_BYTE 0 \
] [get_bd_cells s00_r_node]
create_bd_cell -type ip -vlnv xilinx.com:ip:sc_node:1.0 s00_aw_node
set_property -dict [list \
  CONFIG.ACLKEN_CONVERSION 0 \
  CONFIG.ACLK_RELATIONSHIP 1 \
  CONFIG.ADDR_WIDTH 40 \
  CONFIG.CHANNEL 3 \
  CONFIG.FIFO_TYPE 2 \
  CONFIG.ID_WIDTH 2 \
  CONFIG.M00_NUM_BYTES 16 \
  CONFIG.M01_NUM_BYTES 16 \
  CONFIG.M02_NUM_BYTES 16 \
  CONFIG.M03_NUM_BYTES 16 \
  CONFIG.M04_NUM_BYTES 16 \
  CONFIG.M05_NUM_BYTES 16 \
  CONFIG.M06_NUM_BYTES 16 \
  CONFIG.M07_NUM_BYTES 16 \
  CONFIG.M08_NUM_BYTES 16 \
  CONFIG.M09_NUM_BYTES 16 \
  CONFIG.M10_NUM_BYTES 16 \
  CONFIG.M11_NUM_BYTES 16 \
  CONFIG.M12_NUM_BYTES 16 \
  CONFIG.M13_NUM_BYTES 16 \
  CONFIG.M14_NUM_BYTES 16 \
  CONFIG.M15_NUM_BYTES 16 \
  CONFIG.MAX_PAYLD_BYTES 16 \
  CONFIG.NUM_MI 1 \
  CONFIG.NUM_OUTSTANDING 8 \
  CONFIG.NUM_SI 1 \
  CONFIG.PAYLD_WIDTH 176 \
  CONFIG.S00_NUM_BYTES 16 \
  CONFIG.S01_NUM_BYTES 16 \
  CONFIG.S02_NUM_BYTES 16 \
  CONFIG.S03_NUM_BYTES 16 \
  CONFIG.S04_NUM_BYTES 16 \
  CONFIG.S05_NUM_BYTES 16 \
  CONFIG.S06_NUM_BYTES 16 \
  CONFIG.S07_NUM_BYTES 16 \
  CONFIG.S08_NUM_BYTES 16 \
  CONFIG.S09_NUM_BYTES 16 \
  CONFIG.S10_NUM_BYTES 16 \
  CONFIG.S11_NUM_BYTES 16 \
  CONFIG.S12_NUM_BYTES 16 \
  CONFIG.S13_NUM_BYTES 16 \
  CONFIG.S14_NUM_BYTES 16 \
  CONFIG.S15_NUM_BYTES 16 \
  CONFIG.SC_ROUTE_WIDTH 10 \
  CONFIG.USER_WIDTH 16 \
] [get_bd_cells s00_aw_node]
create_bd_cell -type ip -vlnv xilinx.com:ip:sc_node:1.0 s00_w_node
set_property -dict [list \
  CONFIG.ACLKEN_CONVERSION 0 \
  CONFIG.ACLK_RELATIONSHIP 1 \
  CONFIG.ADDR_WIDTH 40 \
  CONFIG.CHANNEL 1 \
  CONFIG.FIFO_TYPE 2 \
  CONFIG.ID_WIDTH 2 \
  CONFIG.M00_NUM_BYTES 16 \
  CONFIG.M01_NUM_BYTES 16 \
  CONFIG.M02_NUM_BYTES 16 \
  CONFIG.M03_NUM_BYTES 16 \
  CONFIG.M04_NUM_BYTES 16 \
  CONFIG.M05_NUM_BYTES 16 \
  CONFIG.M06_NUM_BYTES 16 \
  CONFIG.M07_NUM_BYTES 16 \
  CONFIG.M08_NUM_BYTES 16 \
  CONFIG.M09_NUM_BYTES 16 \
  CONFIG.M10_NUM_BYTES 16 \
  CONFIG.M11_NUM_BYTES 16 \
  CONFIG.M12_NUM_BYTES 16 \
  CONFIG.M13_NUM_BYTES 16 \
  CONFIG.M14_NUM_BYTES 16 \
  CONFIG.M15_NUM_BYTES 16 \
  CONFIG.MAX_PAYLD_BYTES 16 \
  CONFIG.NUM_MI 1 \
  CONFIG.NUM_OUTSTANDING 8 \
  CONFIG.NUM_SI 1 \
  CONFIG.PAYLD_WIDTH 169 \
  CONFIG.S00_NUM_BYTES 16 \
  CONFIG.S01_NUM_BYTES 16 \
  CONFIG.S02_NUM_BYTES 16 \
  CONFIG.S03_NUM_BYTES 16 \
  CONFIG.S04_NUM_BYTES 16 \
  CONFIG.S05_NUM_BYTES 16 \
  CONFIG.S06_NUM_BYTES 16 \
  CONFIG.S07_NUM_BYTES 16 \
  CONFIG.S08_NUM_BYTES 16 \
  CONFIG.S09_NUM_BYTES 16 \
  CONFIG.S10_NUM_BYTES 16 \
  CONFIG.S11_NUM_BYTES 16 \
  CONFIG.S12_NUM_BYTES 16 \
  CONFIG.S13_NUM_BYTES 16 \
  CONFIG.S14_NUM_BYTES 16 \
  CONFIG.S15_NUM_BYTES 16 \
  CONFIG.SC_ROUTE_WIDTH 10 \
  CONFIG.USER_BITS_PER_BYTE 0 \
] [get_bd_cells s00_w_node]
create_bd_cell -type ip -vlnv xilinx.com:ip:sc_node:1.0 s00_b_node
set_property -dict [list \
  CONFIG.ACLKEN_CONVERSION 0 \
  CONFIG.ACLK_RELATIONSHIP 1 \
  CONFIG.ADDR_WIDTH 40 \
  CONFIG.CHANNEL 4 \
  CONFIG.FIFO_TYPE 2 \
  CONFIG.ID_WIDTH 2 \
  CONFIG.M00_NUM_BYTES 16 \
  CONFIG.M01_NUM_BYTES 16 \
  CONFIG.M02_NUM_BYTES 16 \
  CONFIG.M03_NUM_BYTES 16 \
  CONFIG.M04_NUM_BYTES 16 \
  CONFIG.M05_NUM_BYTES 16 \
  CONFIG.M06_NUM_BYTES 16 \
  CONFIG.M07_NUM_BYTES 16 \
  CONFIG.M08_NUM_BYTES 16 \
  CONFIG.M09_NUM_BYTES 16 \
  CONFIG.M10_NUM_BYTES 16 \
  CONFIG.M11_NUM_BYTES 16 \
  CONFIG.M12_NUM_BYTES 16 \
  CONFIG.M13_NUM_BYTES 16 \
  CONFIG.M14_NUM_BYTES 16 \
  CONFIG.M15_NUM_BYTES 16 \
  CONFIG.MAX_PAYLD_BYTES 16 \
  CONFIG.M_SEND_PIPELINE 0 \
  CONFIG.NUM_MI 1 \
  CONFIG.NUM_OUTSTANDING 8 \
  CONFIG.NUM_SI 1 \
  CONFIG.PAYLD_WIDTH 11 \
  CONFIG.S00_NUM_BYTES 16 \
  CONFIG.S01_NUM_BYTES 16 \
  CONFIG.S02_NUM_BYTES 16 \
  CONFIG.S03_NUM_BYTES 16 \
  CONFIG.S04_NUM_BYTES 16 \
  CONFIG.S05_NUM_BYTES 16 \
  CONFIG.S06_NUM_BYTES 16 \
  CONFIG.S07_NUM_BYTES 16 \
  CONFIG.S08_NUM_BYTES 16 \
  CONFIG.S09_NUM_BYTES 16 \
  CONFIG.S10_NUM_BYTES 16 \
  CONFIG.S11_NUM_BYTES 16 \
  CONFIG.S12_NUM_BYTES 16 \
  CONFIG.S13_NUM_BYTES 16 \
  CONFIG.S14_NUM_BYTES 16 \
  CONFIG.S15_NUM_BYTES 16 \
  CONFIG.SC_ROUTE_WIDTH 4 \
  CONFIG.USER_WIDTH 0 \
] [get_bd_cells s00_b_node]

# ---- hierarchy /s01_entry_pipeline ----
current_bd_instance /s01_entry_pipeline
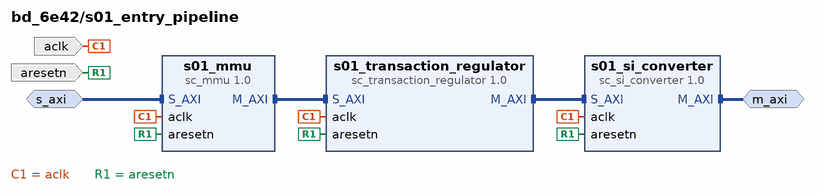
[diagram p6: block diagram inside /s01_entry_pipeline]
create_bd_intf_pin -mode Slave -vlnv xilinx.com:interface:aximm_rtl:1.0 s_axi
create_bd_intf_pin -mode Master -vlnv xilinx.com:interface:aximm_rtl:1.0 m_axi
create_bd_pin -dir I -type clk aclk
create_bd_pin -dir I -type rst aresetn

create_bd_cell -type ip -vlnv xilinx.com:ip:sc_mmu:1.0 s01_mmu
set_property -dict [list \
  CONFIG.ADDR_WIDTH 40 \
  CONFIG.ENABLE_PIPELINING 0 \
  CONFIG.ID_WIDTH 16 \
  CONFIG.IS_CASCADED 0 \
  CONFIG.MSC000_ROUTE 0b1000000011 \
  CONFIG.MSC001_ROUTE 0b1000000101 \
  CONFIG.MSC002_ROUTE 0b1000001001 \
  CONFIG.MSC003_ROUTE 0b1000010001 \
  CONFIG.MSC004_ROUTE 0b1000100001 \
  CONFIG.MSC005_ROUTE 0b1001000001 \
  CONFIG.MSC006_ROUTE 0b1010000001 \
  CONFIG.MSC007_ROUTE 0b1100000001 \
  CONFIG.MSC_ROUTE_WIDTH 10 \
  CONFIG.NUM_MSC 8 \
  CONFIG.NUM_READ_OUTSTANDING 8 \
  CONFIG.NUM_SEG 0 \
  CONFIG.NUM_WRITE_OUTSTANDING 8 \
  CONFIG.RDATA_WIDTH 128 \
  CONFIG.READ_WRITE_MODE READ_WRITE \
  CONFIG.SINGLE_ISSUING 1 \
  CONFIG.SUPPORTS_NARROW 1 \
  CONFIG.S_ARUSER_WIDTH 16 \
  CONFIG.S_AWUSER_WIDTH 16 \
  CONFIG.S_BUSER_WIDTH 0 \
  CONFIG.S_PROTOCOL AXI4 \
  CONFIG.S_RUSER_WIDTH 0 \
  CONFIG.S_WUSER_WIDTH 0 \
  CONFIG.WDATA_WIDTH 128 \
] [get_bd_cells s01_mmu]
create_bd_cell -type ip -vlnv xilinx.com:ip:sc_transaction_regulator:1.0 s01_transaction_regulator
set_property -dict [list \
  CONFIG.ADDR_WIDTH 40 \
  CONFIG.IS_CASCADED 0 \
  CONFIG.MEP_IDENTIFIER 2 \
  CONFIG.MEP_IDENTIFIER_WIDTH 2 \
  CONFIG.NUM_READ_OUTSTANDING 8 \
  CONFIG.NUM_READ_THREADS 1 \
  CONFIG.NUM_WRITE_OUTSTANDING 8 \
  CONFIG.NUM_WRITE_THREADS 1 \
  CONFIG.RDATA_WIDTH 128 \
  CONFIG.READ_WRITE_MODE READ_WRITE \
  CONFIG.SEP_ROUTE_WIDTH 0 \
  CONFIG.SINGLE_ISSUING 1 \
  CONFIG.SUPPORTS_READ_DEADLOCK 0 \
  CONFIG.SUPPORTS_WRITE_DEADLOCK 0 \
  CONFIG.S_ID_WIDTH 16 \
  CONFIG.WDATA_WIDTH 128 \
] [get_bd_cells s01_transaction_regulator]
create_bd_cell -type ip -vlnv xilinx.com:ip:sc_si_converter:1.0 s01_si_converter
set_property -dict [list \
  CONFIG.ADDR_WIDTH 40 \
  CONFIG.HAS_BURST 1 \
  CONFIG.ID_WIDTH 2 \
  CONFIG.IS_CASCADED 0 \
  CONFIG.LIMIT_READ_LENGTH 0 \
  CONFIG.LIMIT_WRITE_LENGTH 0 \
  CONFIG.MAX_RUSER_BITS_PER_BYTE 0 \
  CONFIG.MAX_WUSER_BITS_PER_BYTE 0 \
  CONFIG.MEP_IDENTIFIER_WIDTH 2 \
  CONFIG.MSC000_RDATA_WIDTH 32 \
  CONFIG.MSC000_WDATA_WIDTH 32 \
  CONFIG.MSC001_RDATA_WIDTH 32 \
  CONFIG.MSC001_WDATA_WIDTH 32 \
  CONFIG.MSC002_RDATA_WIDTH 32 \
  CONFIG.MSC002_WDATA_WIDTH 32 \
  CONFIG.MSC003_RDATA_WIDTH 32 \
  CONFIG.MSC003_WDATA_WIDTH 32 \
  CONFIG.MSC004_RDATA_WIDTH 32 \
  CONFIG.MSC004_WDATA_WIDTH 32 \
  CONFIG.MSC005_RDATA_WIDTH 32 \
  CONFIG.MSC005_WDATA_WIDTH 32 \
  CONFIG.NUM_MSC 8 \
  CONFIG.NUM_READ_OUTSTANDING 8 \
  CONFIG.NUM_READ_THREADS 1 \
  CONFIG.NUM_SEG 0 \
  CONFIG.NUM_WRITE_OUTSTANDING 8 \
  CONFIG.NUM_WRITE_THREADS 1 \
  CONFIG.RDATA_WIDTH 128 \
  CONFIG.READ_WATERMARK 0 \
  CONFIG.READ_WRITE_MODE READ_WRITE \
  CONFIG.SINGLE_ISSUING 1 \
  CONFIG.SPLIT_WRAP_NARROW 0 \
  CONFIG.SUPPORTS_NARROW 1 \
  CONFIG.S_RUSER_BITS_PER_BYTE 0 \
  CONFIG.S_WUSER_BITS_PER_BYTE 0 \
  CONFIG.WDATA_WIDTH 128 \
  CONFIG.WRITE_WATERMARK 0 \
] [get_bd_cells s01_si_converter]

# ---- hierarchy /s01_nodes ----
current_bd_instance /s01_nodes
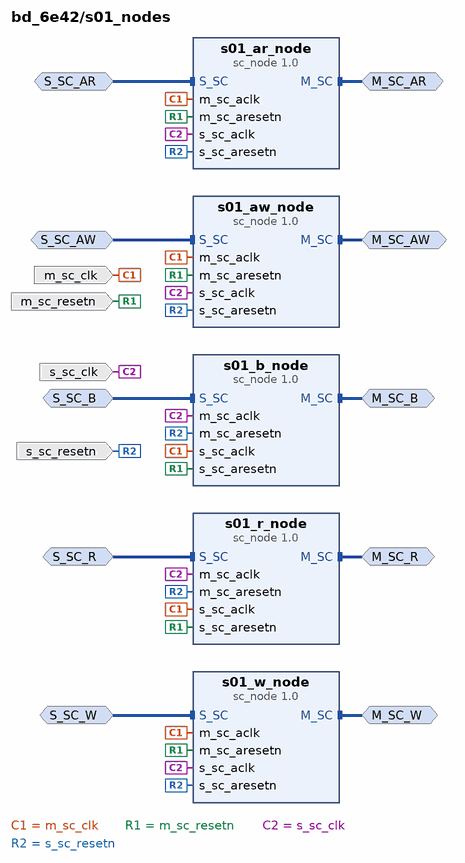
[diagram p7: block diagram inside /s01_nodes]
create_bd_intf_pin -mode Master -vlnv xilinx.com:interface:sc_rtl:1.0 M_SC_AR
create_bd_intf_pin -mode Slave -vlnv xilinx.com:interface:sc_rtl:1.0 S_SC_AR
create_bd_intf_pin -mode Master -vlnv xilinx.com:interface:sc_rtl:1.0 M_SC_R
create_bd_intf_pin -mode Slave -vlnv xilinx.com:interface:sc_rtl:1.0 S_SC_R
create_bd_intf_pin -mode Master -vlnv xilinx.com:interface:sc_rtl:1.0 M_SC_AW
create_bd_intf_pin -mode Slave -vlnv xilinx.com:interface:sc_rtl:1.0 S_SC_AW
create_bd_intf_pin -mode Master -vlnv xilinx.com:interface:sc_rtl:1.0 M_SC_W
create_bd_intf_pin -mode Slave -vlnv xilinx.com:interface:sc_rtl:1.0 S_SC_W
create_bd_intf_pin -mode Master -vlnv xilinx.com:interface:sc_rtl:1.0 M_SC_B
create_bd_intf_pin -mode Slave -vlnv xilinx.com:interface:sc_rtl:1.0 S_SC_B
create_bd_pin -dir I -type clk s_sc_clk
create_bd_pin -dir I -type rst s_sc_resetn
create_bd_pin -dir I -type clk m_sc_clk
create_bd_pin -dir I -type rst m_sc_resetn
